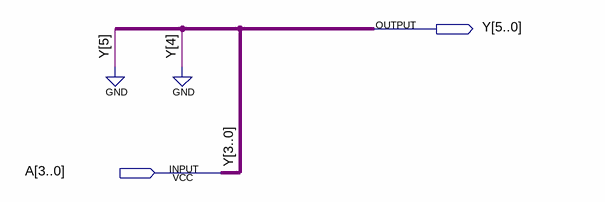
[diagram p0: schematic sheet]
// Quartus schematic extend.bdf as structural Verilog: 0 symbols, 2 pins
module extend (
  input  [3:0] A,
  output [5:0] Y
);


  assign Y = {2'b00, A};
endmodule
